# EAGLE design Arduino Board rev1 (EAGLE 8.5.1)
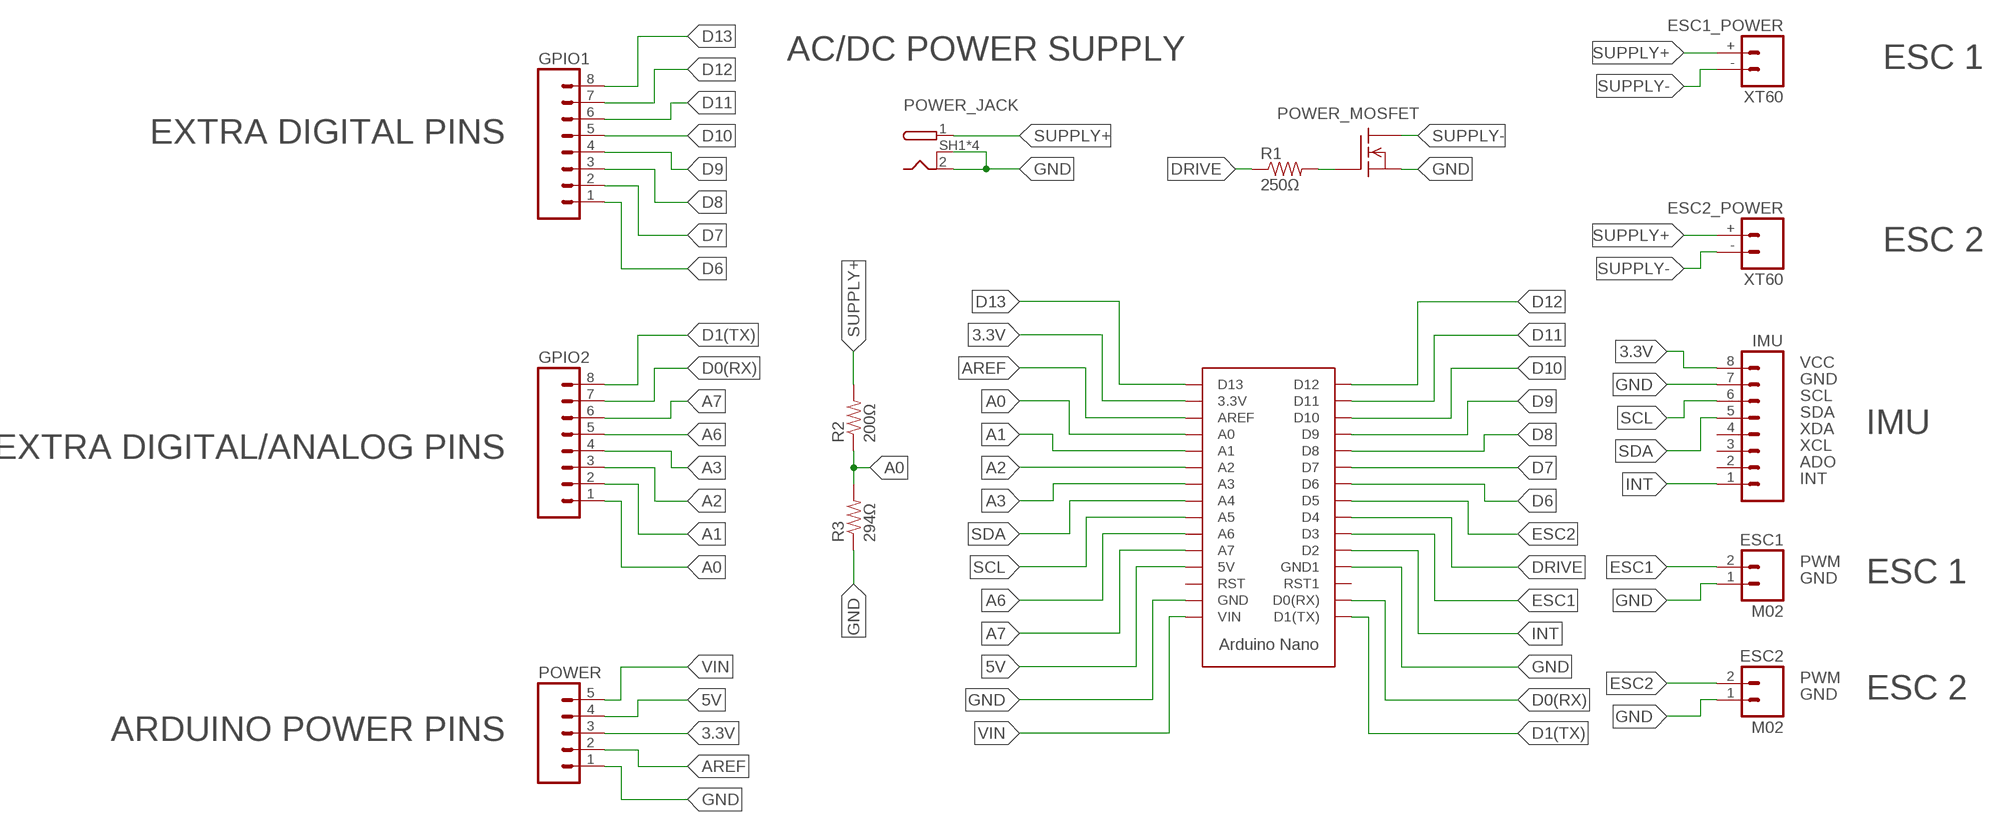
[diagram p0: schematic, sheet 1]

## Parts
ESC1  M02  [1X02]
ESC1_POWER  XT60  [XT60]
ESC2  M02  [1X02]
ESC2_POWER  XT60  [XT60]
GPIO1  M08  [1X08]
GPIO2  M08  [1X08]
IMU  M08  [1X08]
POWER  M05  [1X05]
POWER_JACK  PJ-082BH  [PJ-082BH]
POWER_MOSFET  N-CHANNEL_MOSFETGENERIC  [TO-220-SINK]
R1  250Ω  RESISTORPTH-1/4W  [AXIAL-0.4]
R2  200Ω  RESISTORPTH-1/4W  [AXIAL-0.4]
R3  294Ω  RESISTORPTH-1/4W  [AXIAL-0.4]
U$1  ARDUINO_NANO  [ARDUINO_NANO]

## Nets
3.3V: IMU.8 POWER.3 U$1.3.3V
5V: POWER.4 U$1.5V
A0: GPIO2.1 R2.P$1 R3.P$2 U$1.A0
A1: GPIO2.2 U$1.A1
A2: GPIO2.3 U$1.A2
A3: GPIO2.4 U$1.A3
A6: GPIO2.5 U$1.A6
A7: GPIO2.6 U$1.A7
AREF: POWER.2 U$1.AREF
D0(RX): GPIO2.7 U$1.D0(RX)
D1(TX): GPIO2.8 U$1.D1(TX)
D6: GPIO1.1 U$1.D6
D7: GPIO1.2 U$1.D7
D8: GPIO1.3 U$1.D8
D9: GPIO1.4 U$1.D9
D10: GPIO1.5 U$1.D10
D11: GPIO1.6 U$1.D11
D12: GPIO1.7 U$1.D12
D13: GPIO1.8 U$1.D13
DRIVE: R1.P$1 U$1.D4
ESC1: ESC1.2 U$1.D3
ESC2: ESC2.2 U$1.D5
GND: ESC1.1 ESC2.1 IMU.7 POWER.1 POWER_JACK.2(GND) POWER_JACK.SH1(SHIELD) POWER_JACK.SH2(SHIELD) POWER_JACK.SH3(SHIELD) POWER_JACK.SH4(SHIELD) POWER_MOSFET.3(S) R3.P$1 U$1.GND U$1.GND1
INT: IMU.1 U$1.D2
N$1: POWER_MOSFET.1(G) R1.P$2
SCL: IMU.6 U$1.A5
SDA: IMU.5 U$1.A4
SUPPLY+: ESC1_POWER.+ ESC2_POWER.+ POWER_JACK.1(PWR) R2.P$2
SUPPLY-: ESC1_POWER.- ESC2_POWER.- POWER_MOSFET.2(D)
VIN: POWER.5 U$1.VIN
Unconnected: IMU.2 IMU.3 IMU.4 U$1.RST U$1.RST1

## Notes on the sheet
- AC/DC POWER SUPPLY
- ESC 1
- EXTRA DIGITAL PINS
- ESC 2
- VCC
- GND
- SCL
- SDA
- EXTRA DIGITAL/ANALOG PINS | XDA | IMU
- XCL
- ADO
- INT
- PWM
- GND | ESC 1
- PWM
- GND | ESC 2
- ARDUINO POWER PINS

## Library data of the parts
ESC1 ESC2 = Controls Library:M02: Standard 2-pin 0.1" header. NOTES ON THE VARIANTS LOCK and LOCK_LONGPADS... This footprint was designed to help hold the alignment of a through-hole component (i.e. 6-pin header) while soldering it into place. You may notice that each hole has been shifted either up or down by 0.005 of an inch from it's more standard position (which is a perfectly straight line). This slight alteration caused the pins (the squares in the middle) to touch the edges of the holes. Because they are alternating, it causes a "brace" to hold the component in place. 0.005 has proven to be the perfect amount of "off-center" position when using our standard breakaway headers. Although looks a little odd when you look at the bare footprint, once you have a header in there, the alteration is very hard to notice. Also,if you push a header all the way into place, it is covered up entirely on the bottom side. This idea of altering the position of holes to aid alignment will be further integrated into the Sparkfun Library for other footprints. It can help hold any component with 3 or more connection pins. Note: The Sparkfun version includes many other packages including surface mount that may be of future interest. Source: Sparkfun <https://github.com/sparkfun/SparkFun-Eagle-Libraries>
ESC1_POWER ESC2_POWER = Controls Library:XT60
GPIO1 GPIO2 IMU = Controls Library:M08: Standard 8-pin 0.1" header. NOTES ON THE VARIANTS LOCK and LOCK_LONGPADS... This footprint was designed to help hold the alignment of a through-hole component (i.e. 6-pin header) while soldering it into place. You may notice that each hole has been shifted either up or down by 0.005 of an inch from it's more standard position (which is a perfectly straight line). This slight alteration caused the pins (the squares in the middle) to touch the edges of the holes. Because they are alternating, it causes a "brace" to hold the component in place. 0.005 has proven to be the perfect amount of "off-center" position when using our standard breakaway headers. Although looks a little odd when you look at the bare footprint, once you have a header in there, the alteration is very hard to notice. Also,if you push a header all the way into place, it is covered up entirely on the bottom side. This idea of altering the position of holes to aid alignment will be further integrated into the Sparkfun Library for other footprints. It can help hold any component with 3 or more connection pins. Note: The Sparkfun version includes many other packages including surface mount that may be of future interest. Source: Sparkfun <https://github.com/sparkfun/SparkFun-Eagle-Libraries>
POWER = Controls Library:M05: Standard 5-pin 0.1" header. NOTES ON THE VARIANTS LOCK and LOCK_LONGPADS... This footprint was designed to help hold the alignment of a through-hole component (i.e. 5-pin header) while soldering it into place. You may notice that each hole has been shifted either up or down by 0.005 of an inch from it's more standard position (which is a perfectly straight line). This slight alteration caused the pins (the squares in the middle) to touch the edges of the holes. Because they are alternating, it causes a "brace" to hold the component in place. 0.005 has proven to be the perfect amount of "off-center" position when using our standard breakaway headers. Although looks a little odd when you look at the bare footprint, once you have a header in there, the alteration is very hard to notice. Also,if you push a header all the way into place, it is covered up entirely on the bottom side. This idea of altering the position of holes to aid alignment will be further integrated into the Sparkfun Library for other footprints. It can help hold any component with 3 or more connection pins. Note: The Sparkfun version includes many other packages including surface mount that may be of future interest. Source: Sparkfun <https://github.com/sparkfun/SparkFun-Eagle-Libraries>
POWER_JACK = Controls Library:PJ-082BH
POWER_MOSFET = Controls Library:N-CHANNEL_MOSFET: Generic N-Channel MOSFET; _EXTERNAL_: 1
R1-R3 = Controls Library:RESISTOR: Resistor Basic schematic elements and footprints for 0603, 1206, and PTH resistors.
U$1 = Controls Library:ARDUINO_NANO: Arduino Nano Device Specifications <https://www.arduino.cc/en/Main/ArduinoBoardNano> Pinout Diagram <http://pighixxx.com/nanopdf.pdf>

## Board
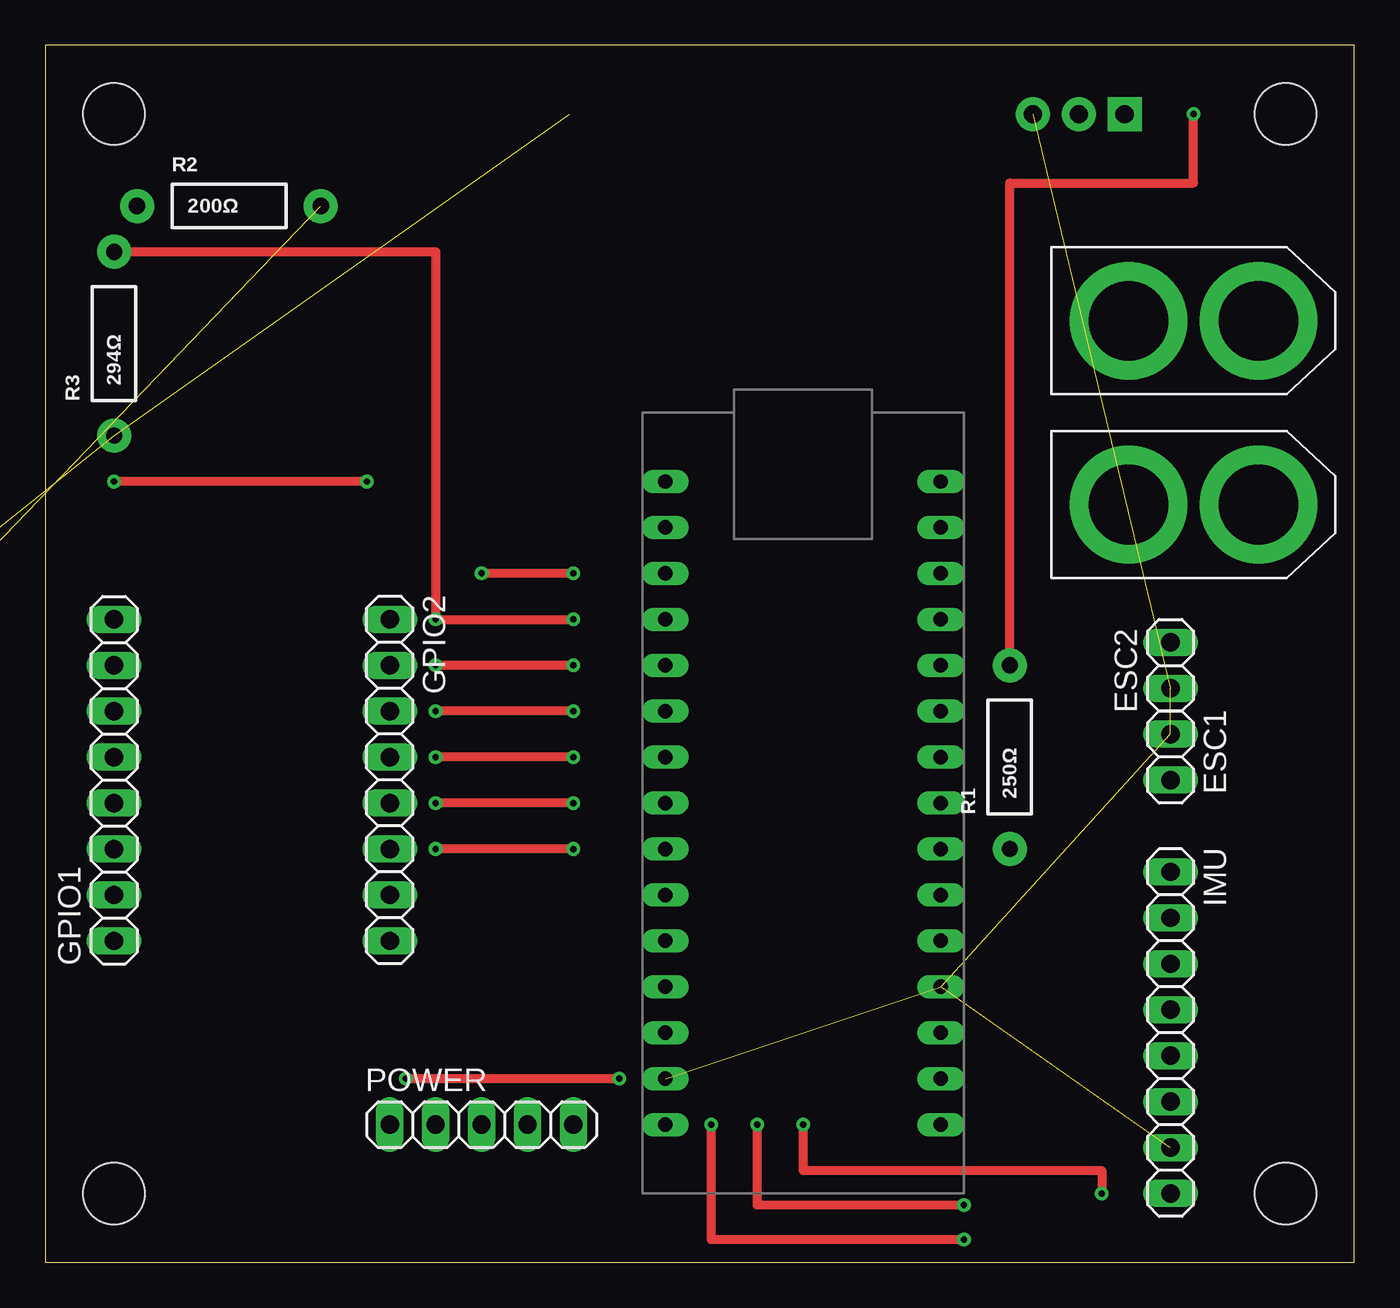
[diagram p1: board, top side]
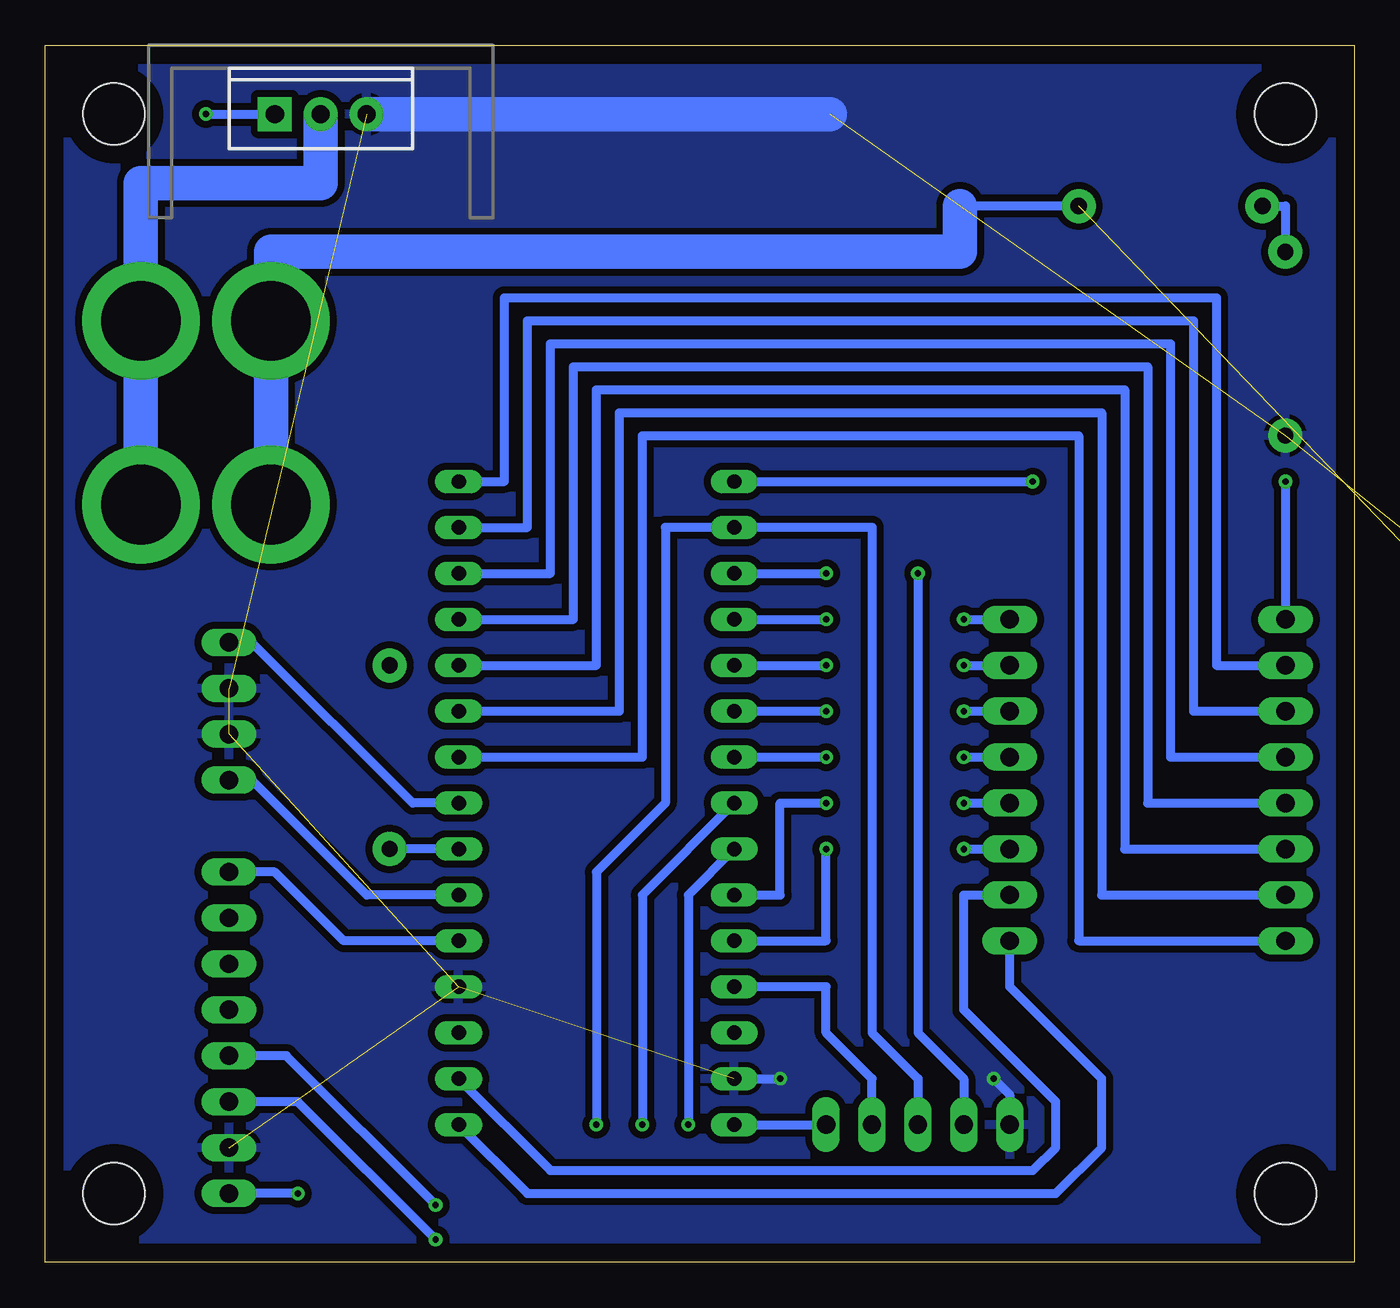
[diagram p2: board, bottom side, seen from below]

Size 72.39 x 67.31 mm. Coordinates in mm from the lower left corner, seen from the top.
Outline: 0,0 72.39,0 72.39,67.31 0,67.31 0,0
Copper layers (1*16): Top 0.035mm / dielectric 1.5mm / Bottom 0.035mm
Design rules "default *": minimum track width 6mil, minimum drill 0.35mm, track to track 15mil, track to pad 15mil, pad to pad 15mil, via to via 15mil, smd to smd 15mil, copper to edge 40mil, drill to drill 6mil, minimum pad ring 10mil, minimum via ring 8mil, stop-mask expansion 4mil, vias tented up to drill 0mil, thermal gap 10mil
Holes 3.4 mm at 68.58,63.5 3.81,63.5 3.81,3.81 68.58,3.81

### Footprints (pad centres in the part's own frame; a part is rotated, then mirrored left to right if it is on the bottom)
1X02 = drill 1.016 long: 1 -1.27,0; 2 1.27,0
XT60 = drill 4.4 pad 6.5: + 0,-3.6; - 0,3.6
1X08 = drill 1.016 long: 1 -8.89,0; 2 -6.35,0; 3 -3.81,0; 4 -1.27,0; 5 1.27,0; 6 3.81,0; 7 6.35,0; 8 8.89,0
1X05 = drill 1.016 long: 1 -5.08,0; 2 -2.54,0; 3 0,0; 4 2.54,0; 5 5.08,0
PJ-082BH = drill 1.7: 1 5.5,0 | drill 2.1: 2 -0.5,0 | drill 2: SH1 -1,4.75; SH2 3.7,4.75; SH3 -1,-4.75; SH4 3.7,-4.75 | hole 1.5: -3.75,0
TO-220-SINK = drill 1 pad 1.88 square: 1 -2.54,0 | drill 1 pad 1.88: 2 0,0; 3 2.54,0
AXIAL-0.4 = drill 0.9 pad 1.88: P$1 -5.08,0; P$2 5.08,0
ARDUINO_NANO = drill 0.8 long: 3.3V 1.27,36.83; 5V 1.27,11.43; A0 1.27,31.75; A1 1.27,29.21; A2 1.27,26.67; A3 1.27,24.13; A4 1.27,21.59; A5 1.27,19.05; A6 1.27,16.51; A7 1.27,13.97; AREF 1.27,34.29; D0(RX) 16.51,6.35; D1(TX) 16.51,3.81; D2 16.51,13.97; D3 16.51,16.51; D4 16.51,19.05; D5 16.51,21.59; D6 16.51,24.13; D7 16.51,26.67; D8 16.51,29.21; D9 16.51,31.75; D10 16.51,34.29; D11 16.51,36.83; D12 16.51,39.37; D13 1.27,39.37; GND 1.27,6.35; GND1 16.51,11.43; RST 1.27,8.89; RST1 16.51,8.89; VIN 1.27,3.81

### Placement (x,y rotation side)
ESC1  62.23,27.94 270 top
ESC1_POWER  63.5,41.91 270 top
ESC2  62.23,33.02 90 top
ESC2_POWER  63.5,52.07 270 top
GPIO1  3.81,26.67 90 top
GPIO2  19.05,26.67 270 top
IMU  62.23,12.7 270 top
POWER  24.13,7.62 0 top
POWER_JACK  -30.48,16.51 0 top  (outside the outline)
POWER_MOSFET  57.15,63.5 0 bottom
R1  53.34,27.94 90 top
R2  10.16,58.42 0 top
R3  3.81,50.8 90 top
U$1  33.02,3.81 0 top

### Tracks (layer width: path | path; a pad name or v marks a point on that pad's centre or on a via)
3.3V  (via drill 0.35)
  Top 0.508: v41.91,7.62 41.91,5.08 58.42,5.08 v58.42,3.81
  Bottom 0.508: POWER.3 24.13,10.16 26.67,12.7 26.67,40.64 U$1.3.3V 38.1,40.64 38.1,25.4 41.91,21.59 v41.91,7.62 | v58.42,3.81 IMU.8
5V
  Bottom 0.508: POWER.4 26.67,10.16 29.21,12.7 29.21,15.24 U$1.5V
A0  (via drill 0.35)
  Top 0.508: v29.21,35.56 v21.59,35.56 21.59,55.88 R3.P$2
  Bottom 0.508: U$1.A0 v29.21,35.56 | v21.59,35.56 GPIO2.1 | R2.P$1 3.81,58.42 R3.P$2
A1  (via drill 0.35)
  Top 0.508: v29.21,33.02 v21.59,33.02
  Bottom 0.508: U$1.A1 v29.21,33.02 | v21.59,33.02 GPIO2.2
A2  (via drill 0.35)
  Top 0.508: v29.21,30.48 v21.59,30.48
  Bottom 0.508: U$1.A2 v29.21,30.48 | v21.59,30.48 GPIO2.3
A3  (via drill 0.35)
  Top 0.508: v29.21,27.94 v21.59,27.94
  Bottom 0.508: U$1.A3 v29.21,27.94 | v21.59,27.94 GPIO2.4
A6  (via drill 0.35)
  Top 0.508: v29.21,25.4 v21.59,25.4
  Bottom 0.508: U$1.A6 31.75,20.32 31.75,25.4 v29.21,25.4 | v21.59,25.4 GPIO2.5
A7  (via drill 0.35)
  Top 0.508: v29.21,22.86 v21.59,22.86
  Bottom 0.508: v29.21,22.86 29.21,17.78 U$1.A7 | v21.59,22.86 GPIO2.6
AREF  (via drill 0.35)
  Top 0.508: v29.21,38.1 v24.13,38.1
  Bottom 0.508: U$1.AREF v29.21,38.1 | v24.13,38.1 24.13,12.7 21.59,10.16 POWER.2
D0(RX)
  Bottom 0.508: U$1.D0(RX) 44.45,5.08 17.78,5.08 16.51,6.35 16.51,8.89 21.59,13.97 21.59,20.32 GPIO2.7
D1(TX)
  Bottom 0.508: U$1.D1(TX) 45.72,3.81 16.51,3.81 13.97,6.35 13.97,10.16 19.05,15.24 GPIO2.8
D6
  Bottom 0.508: U$1.D6 39.37,27.94 39.37,45.72 15.24,45.72 15.24,17.78 GPIO1.1
D7
  Bottom 0.508: U$1.D7 40.64,30.48 40.64,46.99 13.97,46.99 13.97,20.32 GPIO1.2
D8
  Bottom 0.508: U$1.D8 41.91,33.02 41.91,48.26 12.7,48.26 12.7,22.86 GPIO1.3
D9
  Bottom 0.508: U$1.D9 43.18,35.56 43.18,49.53 11.43,49.53 11.43,25.4 GPIO1.4
D10
  Bottom 0.508: U$1.D10 44.45,38.1 44.45,50.8 10.16,50.8 10.16,27.94 GPIO1.5
D11
  Bottom 0.508: U$1.D11 45.72,40.64 45.72,52.07 8.89,52.07 8.89,30.48 GPIO1.6
D12
  Bottom 0.508: U$1.D12 46.99,43.18 46.99,53.34 7.62,53.34 7.62,33.02 GPIO1.7
D13  (via drill 0.35)
  Top 0.508: v17.78,43.18 v3.81,43.18
  Bottom 0.508: U$1.D13 v17.78,43.18 | v3.81,43.18 GPIO1.8
DRIVE
  Bottom 0.508: U$1.D4 R1.P$1
ESC1
  Bottom 0.508: U$1.D3 54.61,20.32 60.96,26.67 ESC1.2
ESC2
  Bottom 0.508: U$1.D5 52.07,25.4 60.96,34.29 ESC2.2
GND  (via drill 0.35)  (11 unrouted)
  Top 0.508: v31.75,10.16 v19.94,10.16
  Bottom 0.508: U$1.GND v31.75,10.16 | v19.94,10.16 19.05,9.27 POWER.1
  Bottom 1.905: 29,63.5 POWER_MOSFET.3
  pour Bottom: 73.66,68.58 73.66,-1.27 -1.27,-1.27 -1.27,68.58
INT
  Bottom 0.508: U$1.D2 55.88,17.78 59.69,21.59 IMU.1
N$1  (via drill 0.35)
  Top 0.508: R1.P$2 53.34,59.69 63.5,59.69 v63.5,63.5
  Bottom 0.508: v63.5,63.5 POWER_MOSFET.1
SCL  (via drill 0.35)
  Top 0.508: v36.83,7.62 36.83,1.27 v50.8,1.27
  Bottom 0.508: U$1.A5 36.83,20.32 v36.83,7.62 | v50.8,1.27 58.42,8.89 IMU.6
SDA  (via drill 0.35)
  Top 0.508: v39.37,7.62 39.37,3.17 v50.8,3.17
  Bottom 0.508: U$1.A4 39.37,20.32 v39.37,7.62 | v50.8,3.17 59.05,11.43 IMU.5
SUPPLY+  (1 unrouted)
  Bottom 0.508: R2.P$2 21.8,58.42
  Bottom 1.905: ESC1_POWER.+ ESC2_POWER.+ 59.9,55.88 21.8,55.88 21.8,58.42
SUPPLY-
  Bottom 1.905: ESC1_POWER.- ESC2_POWER.- 67.1,59.69 57.15,59.69 POWER_MOSFET.2
VIN
  Bottom 0.508: U$1.VIN POWER.5